# Altium schematic sheet motor_output.SchDoc
size A4
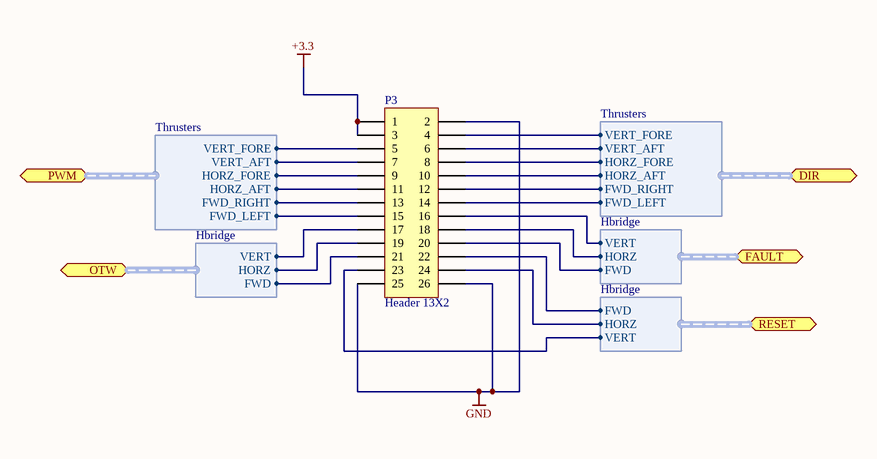
[diagram p0: motor_output.SchDoc]

## Parts
P3  Header 13X2  [HDR2X13]

## Ports
DIR (harness Thrusters), FAULT (harness Hbridge), OTW (harness Hbridge), PWM (harness Thrusters), RESET (harness Hbridge)

## Harnesses
Thrusters: FWD_LEFT, FWD_RIGHT, HORZ_AFT, HORZ_FORE, VERT_AFT, VERT_FORE
Hbridge: VERT, HORZ, FWD
Hbridge: FWD, HORZ, VERT

## Nets
+3.3: P3.1 P3.3
GND: P3.2 P3.25 P3.26
NetP3_4: P3.4 ; port DIR.VERT_FORE
NetP3_5: P3.5 ; port PWM.VERT_FORE
NetP3_6: P3.6 ; port DIR.VERT_AFT
NetP3_7: P3.7 ; port PWM.VERT_AFT
NetP3_8: P3.8 ; port DIR.HORZ_FORE
NetP3_9: P3.9 ; port PWM.HORZ_FORE
NetP3_10: P3.10 ; port DIR.HORZ_AFT
NetP3_11: P3.11 ; port PWM.HORZ_AFT
NetP3_12: P3.12 ; port DIR.FWD_RIGHT
NetP3_13: P3.13 ; port PWM.FWD_RIGHT
NetP3_14: P3.14 ; port DIR.FWD_LEFT
NetP3_15: P3.15 ; port PWM.FWD_LEFT
NetP3_16: P3.16 ; port FAULT.VERT
NetP3_17: P3.17 ; port OTW.VERT
NetP3_18: P3.18 ; port FAULT.HORZ
NetP3_19: P3.19 ; port OTW.HORZ
NetP3_20: P3.20 ; port FAULT.FWD
NetP3_21: P3.21 ; port OTW.FWD
NetP3_22: P3.22 ; port RESET.FWD
NetP3_23: P3.23 ; port RESET.VERT
NetP3_24: P3.24 ; port RESET.HORZ

## Library data of the parts
P3 = Header 13X2: Header, 13-Pin, Dual row; LatestRevisionDate: 17-Jul-2002; LatestRevisionNote: Re-released for DXP Platform.; Publisher: Altium Limited